# Altium schematic sheet PiOBD_CM4_OBD_STN2100.SchDoc
size A3; CopyrightYear: 2021
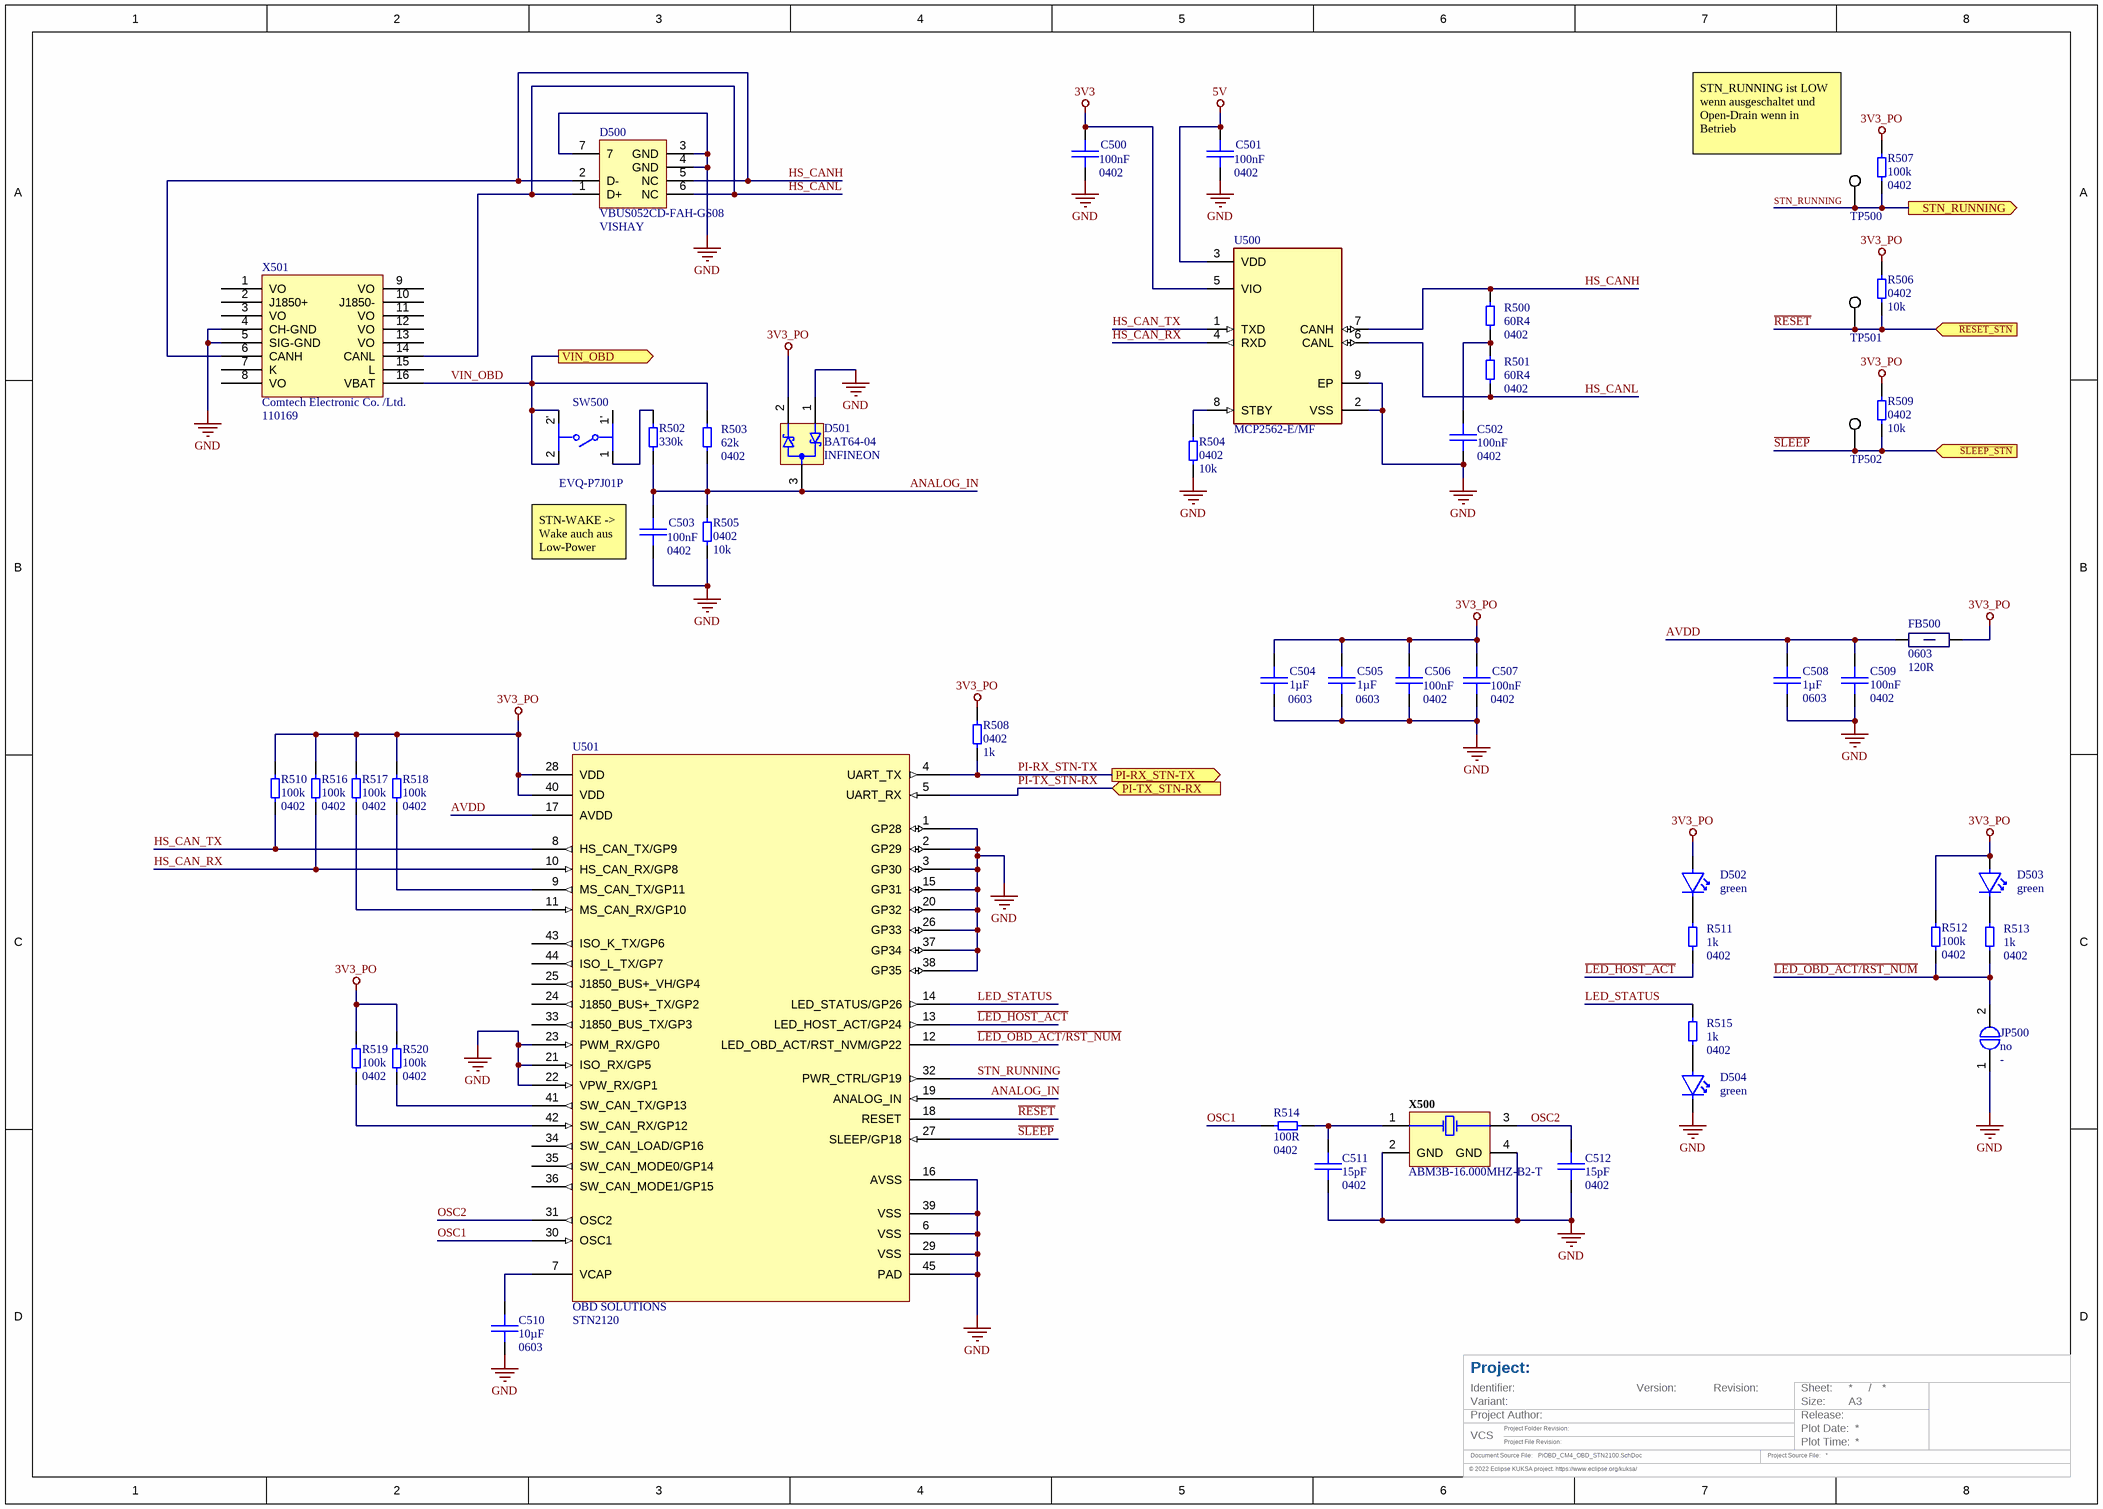
[diagram p0: PiOBD_CM4_OBD_STN2100.SchDoc]

## Parts
C500  Capacitance: 100nF  Case: 0402  [CAP 0402 [1005 Metric] X050 N]  (hidden comment: CAP 0402 100n -10% +10% 6.3V X7R)
C501  Capacitance: 100nF  Case: 0402  [CAP 0402 [1005 Metric] X050 N]  (hidden comment: CAP 0402 100n -10% +10% 6.3V X7R)
C502  Capacitance: 100nF  Case: 0402  [CAP 0402 [1005 Metric] X050 N]  (hidden comment: CAP 0402 100n -10% +10% 6.3V X7R)
C503  Capacitance: 100nF  Case: 0402  [CAP 0402 [1005 Metric] X050 N]  (hidden comment: CAP 0402 100n -10% +10% 6.3V X7R)
C504  Capacitance: 1µF  Case: 0603  [CAP 0603 [1608 Metric] X080 N]  (hidden comment: CAP 0603 1u -10% +10% 10V X7R)
C505  Capacitance: 1µF  Case: 0603  [CAP 0603 [1608 Metric] X080 N]  (hidden comment: CAP 0603 1u -10% +10% 10V X7R)
C506  Capacitance: 100nF  Case: 0402  [CAP 0402 [1005 Metric] X050 N]  (hidden comment: CAP 0402 100n -10% +10% 6.3V X7R)
C507  Capacitance: 100nF  Case: 0402  [CAP 0402 [1005 Metric] X050 N]  (hidden comment: CAP 0402 100n -10% +10% 6.3V X7R)
C508  Capacitance: 1µF  Case: 0603  [CAP 0603 [1608 Metric] X080 N]  (hidden comment: CAP 0603 1u -10% +10% 10V X7R)
C509  Capacitance: 100nF  Case: 0402  [CAP 0402 [1005 Metric] X050 N]  (hidden comment: CAP 0402 100n -10% +10% 6.3V X7R)
C510  Capacitance: 10µF  Case: 0603  [CAP 0603 [1608 Metric] X080 N]  (hidden comment: CAP 0603 10µF -20% +20% 6.3V X5R)
C511  Case: 0402  Capacitance: 15pF  [CAP 0402 [1005 Metric] X050 N]  (hidden comment: CAP 0402 15p -2% +2% 25V C0G)
C512  Case: 0402  Capacitance: 15pF  [CAP 0402 [1005 Metric] X050 N]  (hidden comment: CAP 0402 15p -2% +2% 25V C0G)
D500  Manufacturer Part Number: VBUS052CD-FAH-GS08  Manufacturer: VISHAY  [VISHAY - VBUS052CD-FAH]  (hidden comment: VISHAY - VBUS052CD-FAH-GS08)
D501  Manufacturer Part Number: BAT64-04  Manufacturer: INFINEON  [INFINEON - BAT64-04]  (hidden comment: INFINEON - BAT64-04)
D502  Colour LED1: green  [WUERTH ELEKTRONIK - WL-SMSW]  (hidden comment: WUERTH ELEKTRONIK - 155124VS73200)
D503  Colour LED1: green  [WUERTH ELEKTRONIK - WL-SMSW]  (hidden comment: WUERTH ELEKTRONIK - 155124VS73200)
D504  Colour LED1: green  [WUERTH ELEKTRONIK - WL-SMSW]  (hidden comment: WUERTH ELEKTRONIK - 155124VS73200)
FB500  Case: 0603  Impedance: 120R  [Ferrite Beads 0603 (1608 Metric)]  (hidden comment: MURATA - BLM18AG121SN1D)
JP500  Assembly: no  [Solder Jumper 0402 unbestückt]  (hidden comment: Solder Jumper 0402 unbestückt)
R500  Resistance: 60R4  Case: 0402  [RES 0402 [1005 Metric]_N]  (hidden comment: RES 0402 60R4 1% 0W0625)
R501  Resistance: 60R4  Case: 0402  [RES 0402 [1005 Metric]_N]  (hidden comment: RES 0402 60R4 1% 0W0625)
R502  Resistance: 330k  [RES 0402 [1005 Metric]_N]  (hidden comment: RES 0402 330K 1% 0W0625)
R503  Resistance: 62k  Case: 0402  [RES 0402 [1005 Metric]_N]  (hidden comment: RES 0402 62K 1% 0W0625)
R504  Case: 0402  Resistance: 10k  [RES 0402 [1005 Metric]_N]  (hidden comment: RES 0402 10K 1% 0W0625)
R505  Case: 0402  Resistance: 10k  [RES 0402 [1005 Metric]_N]  (hidden comment: RES 0402 10K 1% 0W0625)
R506  Case: 0402  Resistance: 10k  [RES 0402 [1005 Metric]_N]  (hidden comment: RES 0402 10K 1% 0W0625)
R507  Resistance: 100k  Case: 0402  [RES 0402 [1005 Metric]_N]  (hidden comment: RES 0402 100K 1% 0W0625)
R508  Case: 0402  Resistance: 1k  [RES 0402 [1005 Metric]_N]  (hidden comment: RES 0402 1K 1% 0W0625)
R509  Case: 0402  Resistance: 10k  [RES 0402 [1005 Metric]_N]  (hidden comment: RES 0402 10K 1% 0W0625)
R510  Resistance: 100k  Case: 0402  [RES 0402 [1005 Metric]_N]  (hidden comment: RES 0402 100K 1% 0W0625)
R511  Case: 0402  Resistance: 1k  [RES 0402 [1005 Metric]_N]  (hidden comment: RES 0402 1K 1% 0W0625)
R512  Resistance: 100k  Case: 0402  [RES 0402 [1005 Metric]_N]  (hidden comment: RES 0402 100K 1% 0W0625)
R513  Case: 0402  Resistance: 1k  [RES 0402 [1005 Metric]_N]  (hidden comment: RES 0402 1K 1% 0W0625)
R514  Resistance: 100R  Case: 0402  [RES 0402 [1005 Metric]_N]  (hidden comment: RES 0402 100R 1% 63mW)
R515  Case: 0402  Resistance: 1k  [RES 0402 [1005 Metric]_N]  (hidden comment: RES 0402 1K 1% 0W0625)
R516  Resistance: 100k  Case: 0402  [RES 0402 [1005 Metric]_N]  (hidden comment: RES 0402 100K 1% 0W0625)
R517  Resistance: 100k  Case: 0402  [RES 0402 [1005 Metric]_N]  (hidden comment: RES 0402 100K 1% 0W0625)
R518  Resistance: 100k  Case: 0402  [RES 0402 [1005 Metric]_N]  (hidden comment: RES 0402 100K 1% 0W0625)
R519  Resistance: 100k  Case: 0402  [RES 0402 [1005 Metric]_N]  (hidden comment: RES 0402 100K 1% 0W0625)
R520  Resistance: 100k  Case: 0402  [RES 0402 [1005 Metric]_N]  (hidden comment: RES 0402 100K 1% 0W0625)
SW500  EVQ-P7J01P  [FP-EVQ-P7J01P-MFG]
TP500  Testpad, 0.8mm x 0.8mm, round  [Testpad, 0.8mm x 0.8mm, round]  (value not drawn)  (no BOM)
TP501  Testpad, 0.8mm x 0.8mm, round  [Testpad, 0.8mm x 0.8mm, round]  (value not drawn)  (no BOM)
TP502  Testpad, 0.8mm x 0.8mm, round  [Testpad, 0.8mm x 0.8mm, round]  (value not drawn)  (no BOM)
U500  MCP2562-E/MF  [FP-C04-062-MFG]
U501  Manufacturer: OBD SOLUTIONS  [QFN65P800X800X100_HS-45N]  (hidden comment: OBD SOLUTIONS - STN2120)
X500  ABM3B-16.000MHZ-B2-T  [ABRA-ABM3B-4_V]
X501  Manufacturer: Comtech Electronic Co. /Ltd.  Manufacturer Part Number: 110169  [COMTECH ELECTRONIC - OBD-2 Stiftblock-Footprint-1]  (hidden comment: COMTECH ELECTRONIC - OBD-2 Stiftblock)

## Ports
PI-RX_STN-TX (out), PI-TX_STN-RX (in), STN_RUNNING (out), VIN_OBD (out), ~{RESET_STN} (in), ~{SLEEP_STN} (in)

## Nets
3V3: C500.2 U500.5(VIO)
3V3_PO: C504.1 C505.1 C506.2 C507.2 D501.2 D502.A D503.A FB500.1 R506.1 R507.2 R508.2 R509.1 R510.2 R512.2 R516.2 R517.2 R518.2 R519.2 R520.2 U501.28(VDD) U501.40(VDD)
5V: C501.2 U500.3(VDD)
GND: C500.1 C501.1 C502.2 C503.1 C504.2 C505.2 C506.1 C507.1 C508.2 C509.1 C510.2 C511.1 C512.1 D500.3(GND) D500.4(GND) D500.7 D501.1 D504.C JP500.1 R504.2 R505.2 U500.2(VSS) U500.9(EP) U501.1(GP28) U501.2(GP29) U501.3(GP30) U501.6(VSS) U501.15(GP31) U501.16(AVSS) U501.20(GP32) U501.21(ISO_RX/GP5) U501.22(VPW_RX/GP1) U501.23(PWM_RX/GP0) U501.26(GP33) U501.29(VSS) U501.37(GP34) U501.38(GP35) U501.39(VSS) U501.45(PAD) X500.2(GND) X500.4(GND) X501.4(CH-GND) X501.5(SIG-GND)
~{LED_HOST_ACT}: R511.1 U501.13(LED_HOST_ACT/GP24)
~{LED_OBD_ACT/RST_NUM}: JP500.2 R512.1 R513.1 U501.12(LED_OBD_ACT/RST_NVM/GP22)
~{RESET}: R506.2 TP501.1 U501.18(RESET) ; port ~{RESET_STN}
~{SLEEP}: R509.2 TP502.1 U501.27(SLEEP/GP18) ; port ~{SLEEP_STN}
ANALOG_IN: C503.2 D501.3 R502.1 R503.1 R505.1 U501.19(ANALOG_IN)
AVDD: C508.1 C509.2 FB500.2 U501.17(AVDD)
HS_CAN_RX: R516.1 U500.4(RXD) U501.10(HS_CAN_RX/GP8)
HS_CAN_TX: R510.1 U500.1(TXD) U501.8(HS_CAN_TX/GP9)
HS_CANH: D500.2(D-) D500.5(NC) R500.2 U500.7(CANH) X501.6(CANH)
HS_CANL: D500.1(D+) D500.6(NC) R501.1 U500.6(CANL) X501.14(CANL)
LED_STATUS: R515.2 U501.14(LED_STATUS/GP26)
OSC1: R514.1 U501.30(OSC1)
OSC2: C512.2 U501.31(OSC2) X500.3(X2)
PI-RX_STN-TX: R508.1 U501.4(UART_TX) ; port PI-RX_STN-TX
PI-TX_STN-RX: U501.5(UART_RX) ; port PI-TX_STN-RX
STN_RUNNING: R507.1 TP500.1 U501.32(PWR_CTRL/GP19) ; port STN_RUNNING
VIN_OBD: R503.2 SW500.2 SW500.2' X501.16(VBAT) ; port VIN_OBD
NetC502_1: C502.1 R500.1 R501.2
NetC510_1: C510.1 U501.7(VCAP)
NetC511_2: C511.2 R514.2 X500.1(X1)
NetD502_C: D502.C R511.2
NetD503_C: D503.C R513.2
NetD504_A: D504.A R515.1
NetR502_2: R502.2 SW500.1
NetR504_1: R504.1 U500.8(STBY)
NetR517_1: R517.1 U501.11(MS_CAN_RX/GP10)
NetR518_1: R518.1 U501.9(MS_CAN_TX/GP11)
NetR519_1: R519.1 U501.42(SW_CAN_RX/GP12)
NetR520_1: R520.1 U501.41(SW_CAN_TX/GP13)

Not connected (* = marked no-connect by the designer): SW500 1'; U501 24(J1850_BUS+_TX/GP2) 25(J1850_BUS+_VH/GP4) 33(J1850_BUS_TX/GP3) 34(SW_CAN_LOAD/GP16) 35(SW_CAN_MODE0/GP14) 36(SW_CAN_MODE1/GP15) 43(ISO_K_TX/GP6) 44(ISO_L_TX/GP7); X501 1(VO) 2(J1850+) 3(VO) 7(K) 8(VO) 9(VO) 10(J1850-) 11(VO) 12(VO) 13(VO) 15(L)

## Notes on the sheet
- STN_RUNNING ist LOW wenn ausgeschaltet und Open-Drain wenn in Betrieb
- (near C503) STN-WAKE -> Wake auch aus Low-Power Mode
- Project:
- Identifier:
- Version:
- Revision:
- Sheet:
- /
- VCS
- Variant:
- Document Source File:
- Project Author:
- Project Folder Revision:
- Project File Revision:
- Project Source File:
- Plot Date:
- Size:
- Plot Time:
- Release:
- A3
- © 2022 Eclipse KUKSA project. https://www.eclipse.org/kuksa/
- Drawn by:
- © Robert Bosch GmbH         . All rights reserved, also regarding any disposal, exploitation, reproduction, editing, distribution, as well as in the event of applications for industrial property rights.

## Library data of the parts
C500-C503 C506 C507 C509 = CMP-04212-4: SMD/SMT 0402 6.3V -10% +10% X7R - Multilayer Ceramic Capacitors MLCC; Manufacturer: MURATA; Manufacturer Part Number: GRM155R70J104KA01#; Capacitance Tolerance pos: 10%; Value: 100nF; Assembly: yes; Operating Temperature min: -55°C; Voltage Rating: 6.3V; Operating Temperature max: 125°C; ComponentLink1URL: http://psearch.en.murata.com/capacitor/lineup/grm/; IPC Footprint Naming: CAPC1005X050; Capacitance Tolerance neg: -10%; ComponentLink1Description: Datasheet; Dielectric Type: X7R; Mounting Type: SMT
C504 C505 C508 = CMP-02997-5: SMD/SMT 0603 10V -10% +10% X7R - Multilayer Ceramic Capacitors MLCC; Manufacturer Part Number: GRM188R71A105KA61#; Manufacturer: MURATA; Capacitance Tolerance pos: 10%; Value: 1µF; Assembly: yes; IPC Footprint Naming: CAPC1608X080; Voltage Rating: 10V; Mounting Type: SMT; Operating Temperature max: 125°C; Operating Temperature min: -55°C; ComponentLink1Description: Datasheet; Capacitance Tolerance neg: -10%; ComponentLink1URL: http://psearch.en.murata.com/capacitor/lineup/grm/; Dielectric Type: X7R
C510 = CMP-06061-3: SMT 10µF ±20% 6,3 V Keramikkondensatoren X5R; Manufacturer Part Number: GRM188R60J106ME84; Manufacturer: MURATA; Voltage Rating: 6,3V; Assembly: yes; Operating Temperature max: 85°C; IPC Footprint Naming: CAPC1608X080; Mounting Type: SMT; Dielectric Type: X5R; Value: 10µF; ComponentLink1Description: Datasheet; Capacitance Tolerance pos: 20%; ComponentLink1URL: https://search.murata.co.jp/Ceramy/image/img/A01X/G101/ENG/GRM188R60J106ME84-01.pdf; Operating Temperature min: -55°C; Capacitance Tolerance neg: -20%
C511 C512 = CMP-03766-4: SMD/SMT 0402 25V -2% +2% C0G - Multilayer Ceramic Capacitors MLCC; Manufacturer: MURATA; Manufacturer Part Number: GRM1555C1E150GA01#; Capacitance Tolerance pos: 2%; Value: 15pF; Dielectric Type: C0G (NP0); Assembly: yes; Mounting Type: SMT; Operating Temperature max: 125°C; ComponentLink1Description: Datasheet; IPC Footprint Naming: CAPC1005X050; Voltage Rating: 25V; ComponentLink1URL: http://psearch.en.murata.com/capacitor/lineup/grm/; Capacitance Tolerance neg: -2%; Operating Temperature min: -55°C
D500 = CMP-04945-2: 2-Line BUS-Port ESD-Protection - Flow Through Design; ESD Voltage Contact: 0V; No. of Channels: 2; Breakdown Voltage: 7.9V; Assembly: yes; Mounting Type: SMT; Operating Temperature max: 125°C; Operating Temperature min: -40°C; Case: 6-UDFN; ComponentLink1Description: Datasheet; ComponentLink1URL: http://www.vishay.com/docs/81881/vbus052c.pdf; ESD Voltage Air: 0V
D501 = CMP-07202-6: Dual Silicon Schottky Diodes in series configuration; Reverse Voltage: 40V; Forward Voltage: 750mV; Forward Current: 250mA; Assembly: yes; Case: SOT-23; ComponentLink1URL: https://www.infineon.com/dgdl/Infineon-BAT64SERIES-DataSheet-v01_00-EN.pdf?fileId=5546d4626d66c2b1016d73f85ab420ed; ComponentLink1Description: Datasheet; Mounting Type: SMT; Operating Temperature max: 150°C; Operating Temperature min: -55°C
D502-D504 = CMP-11200-1: LED, GREEN, Right Angle SMD 3.2*1.0mm WL-SMSW SMT Mono-color Side view Waterclear; Forward Current LED1: 25mA; Reverse Voltage LED1: 5V; Assembly: yes; Luminous Intensity LED1: 150mcd; Forward Voltage LED1: 3.4V; Wavelength LED1: 470nm; View Angle: 120°; Operating Temperature min: -40°C; Mounting Type: SMT; Manufacturer: WUERTH ELEKTRONIK; Case: 1305; ComponentLink1URL: https://katalog.we-online.de/led/datasheet/155124BS73200.pdf; Operating Temperature max: 85°C; Manufacturer Part Number: 155124VS73200; ComponentLink1Description: Datahseet
FB500 = CMP-07546-1: 120 Ohms @ 100MHz 1 Power Line Ferrite Bead 0603 (1608 Metric) 800mA 180mOhm; Assembly: yes; Resistance DC: 0,18; Impedance 100MHz: 120R (100MHz); ComponentLink1URL: https://datasheet.octopart.com/BLM18AG121SN1D-Murata-datasheet-135086654.pdf; ComponentLink1Description: Manufacturer Link; Current Rating DC: 800mA; Operating Temperature max: 125°C; Manufacturer: MURATA; Manufacturer Part Number: BLM18AG121SN1D; Mounting Type: SMT; Operating Temperature min: -55°C
JP500 = CMP-04662-6: Operating Temperature min: 0°C; Case: -; ComponentLink1Description: Datasheet; Manufacturer: -; Manufacturer Part Number: -; Mounting Type: SMT; Operating Temperature max: 0°C
R500 R501 = CMP-00705-5: RC0402 series chip resistor with lead-free terminations made by thick film process; Manufacturer Part Number: RC0402FR-0760R4L; Manufacturer: YAGEO; Temperature Coefficient: ±100ppm/K; Current Rating: 1A; Power Rating: 62.5mW; Voltage Rating: 50V; Assembly: yes; Value: 60.4; ComponentLink1URL: http://www.yageo.com/documents/recent/PYu-RC0402_51_RoHS_L_6.pdf; Operating Temperature max: 155°C; ComponentLink1Description: Datasheet; Resistor Element Type: Thick Film; IPC Footprint Naming: RESC1005X04; Resistance Tolerance: 1%; Mounting Type: SMT; Operating Temperature min: -55°C
R502 = CMP-01136-6: RC0402 series chip resistor with lead-free terminations made by thick film process; Manufacturer Part Number: RC0402FR-07330KL; Manufacturer: YAGEO; Temperature Coefficient: ±100ppm/K; Current Rating: 1A; Power Rating: 62,5mW; Voltage Rating: 50V; Assembly: yes; Operating Temperature min: -55°C; Value: 330k; Resistance Tolerance: 1%; Case: 0402 [1005]; Resistor Element Type: Thick Film; Mounting Type: SMT; Operating Temperature max: 155°C; IPC Footprint Naming: RESC1005X04; ComponentLink1Description: Datasheet; ComponentLink1URL: http://www.yageo.com/documents/recent/PYu-RC0402_51_RoHS_L_6.pdf
R503 = CMP-01051-5: RC0402 series chip resistor with lead-free terminations made by thick film process; Manufacturer Part Number: RC0402FR-0762KL; Manufacturer: YAGEO; Voltage Rating: 50V; Assembly: yes; Current Rating: 1A; Power Rating: 62.5mW; Temperature Coefficient: ±100ppm/K; Value: 62k; ComponentLink1URL: http://www.yageo.com/documents/recent/PYu-RC0402_51_RoHS_L_6.pdf; IPC Footprint Naming: RESC1005X04; Mounting Type: SMT; Resistor Element Type: Thick Film; ComponentLink1Description: Datasheet; Operating Temperature min: -55°C; Operating Temperature max: 155°C; Resistance Tolerance: 1%
R504-R506 R509 = CMP-00958-6: RC0402 series chip resistor with lead-free terminations made by thick film process; Manufacturer Part Number: RC0402FR-0710KL; Manufacturer: YAGEO; Voltage Rating: 50V; Temperature Coefficient: ±100ppm/K; Assembly: yes; Current Rating: 1A; Power Rating: 62.5mW; Resistance Tolerance: 1%; Value: 10k; Resistor Element Type: Thick Film; ComponentLink1Description: Datasheet; IPC Footprint Naming: RESC1005X04; Mounting Type: SMT; ComponentLink1URL: http://www.yageo.com/documents/recent/PYu-RC0402_51_RoHS_L_6.pdf; Operating Temperature min: -55°C; Operating Temperature max: 155°C
R507 R510 R512 R516-R520 = CMP-01074-5: RC0402 series chip resistor with lead-free terminations made by thick film process; Manufacturer Part Number: RC0402FR-07100KL; Manufacturer: YAGEO; Temperature Coefficient: ±100ppm/K; Current Rating: 1A; Assembly: yes; Power Rating: 62.5mW; Voltage Rating: 50V; Mounting Type: SMT; ComponentLink1URL: http://www.yageo.com/documents/recent/PYu-RC0402_51_RoHS_L_6.pdf; Operating Temperature max: 155°C; Operating Temperature min: -55°C; Resistor Element Type: Thick Film; IPC Footprint Naming: RESC1005X04; ComponentLink1Description: Datasheet; Value: 100k; Resistance Tolerance: 1%
R508 R511 R513 R515 = CMP-00843-5: RC0402 series chip resistor with lead-free terminations made by thick film process; Manufacturer Part Number: RC0402FR-071KL; Manufacturer: YAGEO; Power Rating: 62.5mW; Current Rating: 1A; Temperature Coefficient: ±100ppm/K; Voltage Rating: 50V; Assembly: yes; Resistance Tolerance: 1%; ComponentLink1URL: http://www.yageo.com/documents/recent/PYu-RC0402_51_RoHS_L_6.pdf; Mounting Type: SMT; Value: 1k; Operating Temperature min: -55°C; ComponentLink1Description: Datasheet; IPC Footprint Naming: RESC1005X04; Operating Temperature max: 155°C; Resistor Element Type: Thick Film
R514 = CMP-06970-3: RC0402 series chip resistor with lead-free terminations made by thick film process; Manufacturer: ROHM; Manufacturer Part Number: MCR01MZPF100; Assembly: yes; Temperature Coefficient: ±100ppm/K; eADM Name: 8905501369; Voltage Rating: 50V; Value: 100; Current Rating: 1A; IPC Footprint Naming: RESC1005X04; Operating Temperature min: -55°C; Resistor Element Type: Thick Film; Resistance Tolerance: 1%; ComponentLink1URL: https://www.rohm.com/site-search?p_p_id=rohmsitesearch_WAR_rohmcomboportlet&p_p_lifecycle=1&p_p_state=normal&_rohmsitesearch_WAR_rohmcomboportlet_action=siteSearchAction&p_auth=xKaajgv6; ComponentLink1Description: Datasheet; Operating Temperature max: 155°C; Power Rating: 63mW; Mounting Type: SMT
SW500 = CMP-05618-000001-1: SWITCH TACTILE SPST-NO 0.05A 12V; Manufacturer: Panasonic; Operating Force: 1.6N; Contact Current Rating: 50mA; Electromechanical Life: 100000Cycles; Contact Resistance: 500mΩ; Height: 1.55mm; Temperature Range Low: -20°C; Device Class L1: Electromechanical; Package: 0; RoHS: TRUE; Category: Switch; ComponentLink2Description: Datasheet; Device Class L2: Switches; Temperature Range High: +70°C; Mount: Surface Mount; Device Class L3: Tactile Switches; Temperature: -20°C to +70°C; Automotive: No; Manufacturer Part Number: EVQ-P7J01P; Mouser Description: Tactile Switches 3.5x2.9mm Right Ang Light Touch Switch; ComponentLink2URL: https://b2b-api.panasonic.eu/file_stream/pids/fileversion/2431; Lead Free: Yes; Octopart: https://octopart.com/evq-p7j01p-panasonic-29917078; Digikey Description: SWITCH TACTILE SPST-NO 0.05A 12V; Voltage Rating Dc: 12V; Throw Configuration: SPST-NO
TP500-TP502 = CMP-00390-13: Assembly: no; Case: 0.8x0.8mm, round
U500 = CMP-06279-000001-1: IC TRANSCEIVER HALF 1/1 8DFN; Manufacturer: Microchip Technology; Standoff Height: 0mm; Nominal Supply Current: 5-45mA; Max Junction Temp: +190°C; Automotive Grade: Grade 0; Max Supply Voltage: 5.5V; Min Supply Voltage: 1.8V; Interface: CAN; ComponentLink2URL: http://ww1.microchip.com/downloads/en/DeviceDoc/20005167C.pdf; Temperature Range Low: -40°C; ComponentLink2Description: Datasheet; Lead Free: Yes; Package: C04-062; Octopart: https://octopart.com/mcp2562-e%2Fmf-microchip-28494619; Category: IC; Ipc Land Pattern Name: DFN300X300X90-8; Digikey Description: IC TRANSCEIVER HALF 1/1 8DFN; RoHS: TRUE; Ambient Temperature Range High: +150°C; Device Class L3: unset; Ambient Temperature Range Low: -40°C; Device Class L1: Integrated Circuits (ICs); Mouser Description: CAN Interface IC; Device Class L2: Interface ICs; Manufacturer Part Number: MCP2562-E/MF; Temperature Range High: +125°C; Automotive: Yes; Temperature: -40°C to +125°C; Height: 1mm
U501 = CMP-06092-6: The STN2120 and STN2100 are OBD to UART interpreter ICs designed to provide bi-directional, halfduplex communication with the vehicle¿s On-Board Diagnostic system (OBD-II).; Assembly: yes; Supply Voltage min: 3V; Supply Voltage max: 3,6V; ComponentLink1Description: Datasheet; Mounting Type: SMT; Manufacturer Part Number: STN2120; Case: QFN-44; Operating Temperature min: -40°C; Operating Temperature max: 85°C; ComponentLink1URL: https://www.obdsol.com/solutions/chips/stn2120/
X500 = CMP-1688-00003-1: Ceramic SMD Crystal, 16 MHz, +/- 20 ppm, 50 Ohm, -20 to 70 degC, 4-Pin SMD, RoHS, Tape and Reel; Current Rating: 1.82 A; Resistance: 0.033 Ohm; Tolerance: 30%; Shielding: Shielded; REACH SVHC: Unknown; RoHSCompliant: True; PackageReference: ABM3B; Mount: Surface Mount; Max Operating Temperature: 105degC; DatasheetVersion: Aug-15; Package Quantity: 500; PackageDescription: 4-Pin Surface Mount Device, Body 5 x 3.2 mm; ComponentLink2URL: http://www.abracon.com/Resonators/abm3b.pdf; Packaging: Tape and Reel; Height: 2.8 mm; ComponentLink1URL: http://www.abracon.com/; ComponentLink2Description: Datasheet; Length: 0.197 inch; ComponentLink1Description: Manufacturer URL; Case/Package: 5028; Width: 0.197 inch; Min Operating Temperature: -40degC
X501 = CMP-11115-2: OBD-2 Stiftblock männlich PCB TH PKW Typ A; Assembly: yes; Pitch Spacing: 4mm; Number of Position: 16; Case: OBD-II-16M; Operating Temperature max: 85°C; Socket for Case Type: OBD-2; ComponentLink1URL: https://www.obd2-shop.eu/product_info.php/cPath/21_65_69/products_id/169; ComponentLink1Description: Manufacturer Link; Number of Rows: 2; Mounting Type: THT; Operating Temperature min: -40°C